# EAGLE design Addon-mapleCUx_OneWire-RS485-003 (EAGLE 7.3.0)
MAPLE-CUx Large Version
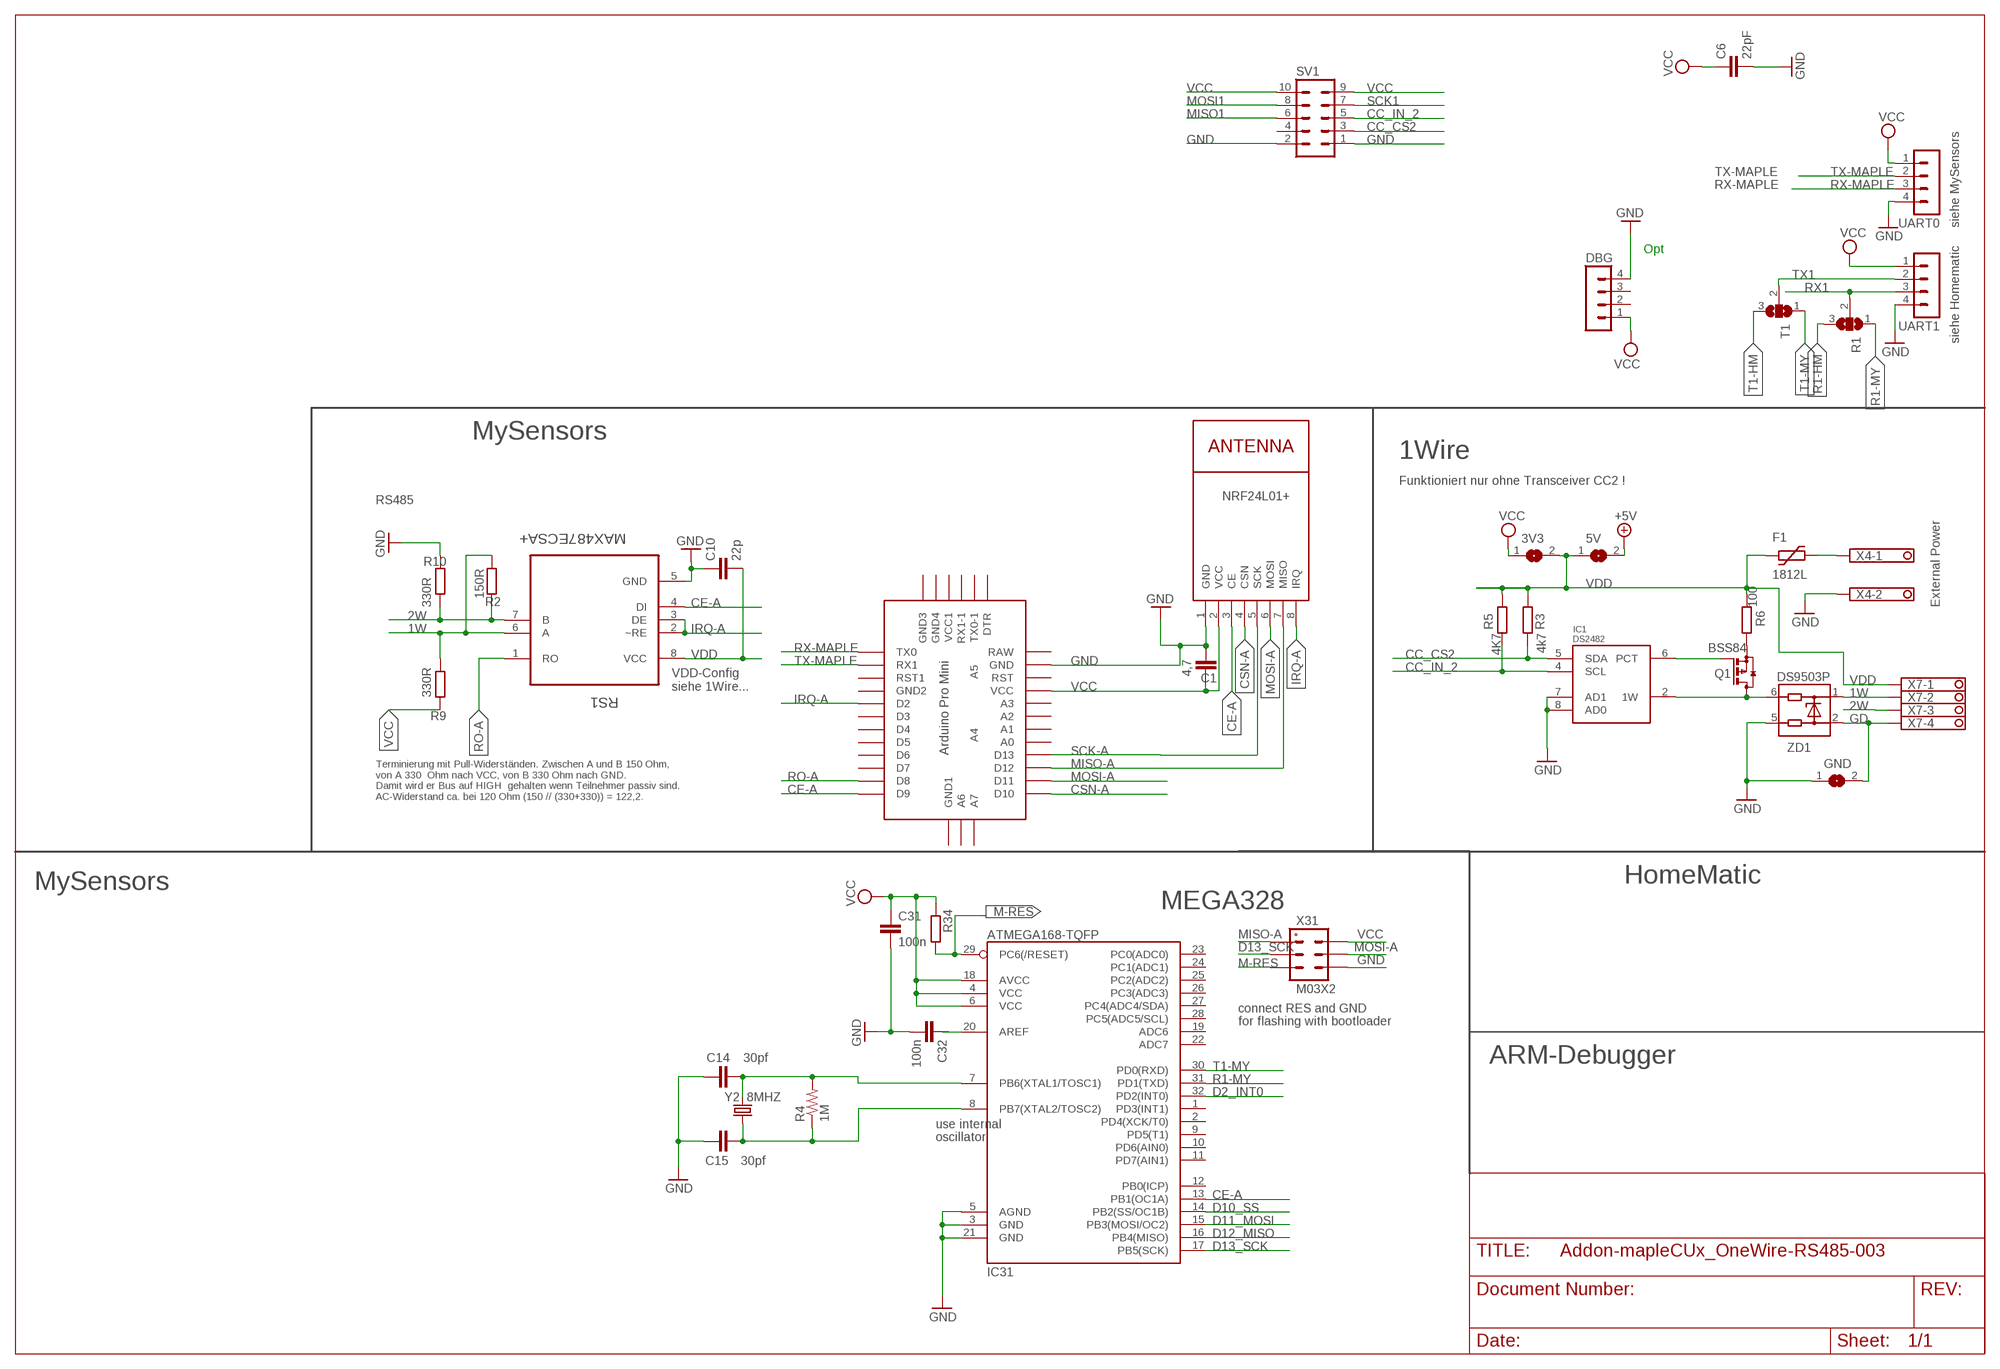
[diagram p0: schematic, sheet 1]

## Parts
3V3  SJ  [SJ]
5V  SJ  [SJ]
C1  4,7  C-EUC1210  [C1210]
C6  22pF  C-EUC0805  [C0805]
C10  22p  C-EUC0805  [C0805]
C14  30pf  CAP0805  [0805]
C15  30pf  CAP0805  [0805]
C31  100n  C-EUC0805  [C0805]
C32  100n  C-EUC0805  [C0805]
DBG  MA04-1  [MA04-1]
F1  1812L  [1812L]
GND  SJ  [SJ]
IC1  DS2482  DS2482-100S  [SO08]
IC31  ATMEGA168-TQFP  [TQFP32-08]
NRF24L01+  NRF24L01+  WIRELESS-NRF24L01  [WIRELESS-NRF24L01]
Q1  BSS84  [SOT23]
R1  SJ2W  [SJ_2]
R2  150R  R-EU_R0805  [R0805]
R3  4k7  R-EU_R0805  [R0805]
R4  1M  RESISTOR0805-RES  [0805]
R5  4K7  R-EU_R0805  [R0805]
R6  100  R-EU_R0805  [R0805]
R9  330R  R-EU_R0805  [R0805]
R10  330R  R-EU_R0805  [R0805]
R34  R-EU_R0805  [R0805]
RS1  MAX487ECSA+  [SOIC127P600X175-8N]
SV1  MA05-2  [MA05-2]
T1  SJ2W  [SJ_2]
U$1  ABK-PRO-MINI  [ABK-PRO-MINI]
UART0  MA04-1  [MA04-1]
UART1  MA04-1  [MA04-1]
X4  1751248  [1751248]
X7  1751264  [1751264]
X31  M03X2  [2X03-1.27MM_SMD]
Y2  8MHZ  CRYSTALTXC-7A  [CRYSTAL-TXC-7A]
ZD1  DS9503P  [TSOC6]

## Nets
1W: R2.1 R9.2 RS1.6(A) X7.2 ZD1.1
2W: R2.2 R10.1 RS1.7(B) X7.3
+5V [PWR]: 5V.2
CC_CS2: IC1.5(SDA) R3.2 SV1.3
CC_IN_2: IC1.4(SCL) R5.2 SV1.5
CE-A: IC31.13(PB1(OC1A)) NRF24L01+.3(CE) RS1.4(DI) U$1.D9
CSN-A: NRF24L01+.4(CSN) U$1.D10
D2_INT0: IC31.32(PD2(INT0))
D10_SS: IC31.14(PB2(SS/OC1B))
D11_MOSI: IC31.15(PB3(MOSI/OC2))
D12_MISO: IC31.16(PB4(MISO))
D13_SCK: IC31.17(PB5(SCK)) X31.P$3
GD [PWR]: GND.2 X7.4 ZD1.2
GND [PWR]: C1.1 C6.2 C10.1 C14.1 C15.1 C31.2 C32.2 DBG.4 GND.1 IC1.7(AD1) IC1.8(AD0) IC31.3(GND) IC31.5(AGND) IC31.21(GND) NRF24L01+.1(GND) R10.2 RS1.5(GND) SV1.1 SV1.2 U$1.GND UART0.4 UART1.4 X4.2 X31.P$6 ZD1.5
IRQ-A: NRF24L01+.8(IRQ) RS1.2(~RE) RS1.3(DE) U$1.D2
M-RES: IC31.29(PC6(/RESET)) R34.2 X31.P$5
MISO1: SV1.6
MISO-A: NRF24L01+.7(MISO) U$1.D12 X31.P$1
MOSI1: SV1.8
MOSI-A: NRF24L01+.6(MOSI) U$1.D11 X31.P$4
N$3: C14.2 IC31.7(PB6(XTAL1/TOSC1)) R4.2 Y2.P$2
N$13: C32.1 IC31.20(AREF)
N$19: C15.2 IC31.8(PB7(XTAL2/TOSC2)) R4.1 Y2.P$1
N$45 [PWR]: F1.P$2 X4.1
N$47: IC1.6(PCT) Q1.1(G)
N$48: IC1.2(1W) Q1.3(D) ZD1.6
N$52: Q1.2(S) R6.1
R1-HM: R1.3
R1-MY: IC31.31(PD1(TXD)) R1.1
RO-A: RS1.1(RO) U$1.D8
RX1: R1.2 UART1.3
RX-MAPLE: U$1.TX0 UART0.3
SCK1: SV1.7
SCK-A: NRF24L01+.5(SCK) U$1.D13
T1-HM: T1.3
T1-MY: IC31.30(PD0(RXD)) T1.1
TX1: T1.2 UART1.2
TX-MAPLE: U$1.RX1 UART0.2
VCC [PWR]: 3V3.1 C1.2 C6.1 C31.1 DBG.1 IC31.4(VCC) IC31.6(VCC) IC31.18(AVCC) NRF24L01+.2(VCC) R9.1 R34.1 SV1.9 SV1.10 U$1.VCC UART0.1 UART1.1 X31.P$2
VDD [PWR]: 3V3.2 5V.1 C10.2 F1.P$1 R3.1 R5.1 R6.2 RS1.8(VCC) X7.1
Unconnected: DBG.2 DBG.3 IC31.1(PD3(INT1)) IC31.2(PD4(XCK/T0)) IC31.9(PD5(T1)) IC31.10(PD6(AIN0)) IC31.11(PD7(AIN1)) IC31.12(PB0(ICP)) IC31.19(ADC6) IC31.22(ADC7) IC31.23(PC0(ADC0)) IC31.24(PC1(ADC1)) IC31.25(PC2(ADC2)) IC31.26(PC3(ADC3)) IC31.27(PC4(ADC4/SDA)) IC31.28(PC5(ADC5/SCL)) SV1.4 U$1.A0 U$1.A1 U$1.A2 U$1.A3 U$1.A4 U$1.A5 U$1.A6 U$1.A7 U$1.D3 U$1.D4 U$1.D5 U$1.D6 U$1.D7 U$1.DTR U$1.GND1(GND2) U$1.GND2(GND3) U$1.GND3(GND4) U$1.GND4(GND1) U$1.RAW U$1.RST U$1.RST1 U$1.RX1-1 U$1.TX0-1 U$1.VCC1

## Notes on the sheet
- siehe MySensors
- Opt
- siehe Homematic
- MySensors
- 1Wire
- Funktioniert nur ohne Transceiver CC2 !
- RS485
- External Power
- VDD-Config
  siehe 1Wire...
- Terminierung mit Pull-Widerständen. Zwischen A und B 150 Ohm,
  von A 330  Ohm nach VCC, von B 330 Ohm nach GND. 
  Damit wird er Bus auf HIGH  gehalten wenn Teilnehmer passiv sind.
  AC-Widerstand ca. bei 120 Ohm (150 // (330+330)) = 122,2.
- MySensors | HomeMatic
- MEGA328
- connect RES and GND
- for flashing with bootloader
- ARM-Debugger
- use internal
- oscillator

## Power pins joined to a net without a drawn wire
GND: IC1.3(GND)
VDD: IC1.1(VDD)

## Library data of the parts
3V3 5V GND = jumper:SJ: SMD solder JUMPER
C1 C6 C10 C31 C32 = rcl:C-EU: CAPACITOR, European symbol
C14 C15 = doug:CAP: Capacitor Standard 0603 ceramic capacitor, and 0.1" leaded capacitor.
DBG UART0 UART1 = con-lstb:MA04-1: PIN HEADER; OC_FARNELL: unknown; OC_NEWARK: unknown
F1 = ptc-littlefuse:1812L
IC1 = 1wire:DS2482-100: I2C to 1-Wire Host Adapter/Line Driver This device is a onewire host and I2C interface in one chip. It provides the complete DC/AC requirements for onewire communication, including overdrive speed mode, but, unlike the DS2480B chip, no 12V EPROM programming. Notes: For overdrive speed and 5V EEPROM programming, an external active pullup circuit must be connected to the 1W, VDD and PCT pin. See the datasheet for details. The lower two I2C adress bits of the chip can be selected by external pins, so up to 4 chips may be connected to the same I2C bus. Author: Orginal device and description from Giovanni Varasano <giovanni.varasano@fastwebnet.it> Improved by Jan Kandziora <jjj@gmx.de>
IC31 = atmel:ATMEGA168: Atmel Atmega 168/328/328P
NRF24L01+ = diy-modules:WIRELESS-NRF24L01: 2.4 GHz Wireless Module based on NRF24L01 chip
Q1 = transistor-small-signal:BSS84: P-CHANNEL MOS FET
R1 T1 = jumper:SJ2W: SMD solder JUMPER
R2 R3 R5 R6 R9 R10 R34 = rcl:R-EU_: RESISTOR, European symbol
R4 = doug:RESISTOR: Resistor Basic schematic elements and footprints for 0603, 1206, and PTH resistors.
RS1 = Maxim_By_element14_Batch_1:MAX487ECSA+: Low-Power, Slew-Rate-Limited RS-485/RS-422 Transceivers; MPN: MAX487ECSA+; OC_FARNELL: 9724532; OC_NEWARK: 68K4803; PACKAGE: SOIC-8; SUPPLIER: Maxim
SV1 = con-lstb:MA05-2: PIN HEADER; OC_FARNELL: unknown; OC_NEWARK: unknown
U$1 = Arduino-clone:ABK-PRO-MINI: ABK Pro-Mini Arduino Clone
X4 = con-phoenix-350:1751248: MKDS 1/ 2-3,5 Printklemme Nennstrom: 10 A Bemessungsspannung: 160 V Raster: 3,5 mm Polzahl: 2 Montageart: Löten Anschlussart: Schraubanschluss Anschlussrichtung vom Leiter zur Platine: 0° Source: http://eshop.phoenixcontact.com .. 1751248.pdf; OC_FARNELL: unknown; OC_NEWARK: unknown
X7 = con-phoenix-350:1751264: MKDS 1/ 4-3,5 Printklemme Nennstrom: 10 A Bemessungsspannung: 160 V Raster: 3,5 mm Polzahl: 4 Montageart: Löten Anschlussart: Schraubanschluss Anschlussrichtung vom Leiter zur Platine: 0° Source: http://eshop.phoenixcontact.com .. 1751264.pdf; MPN: 1751264; OC_FARNELL: unknown; OC_NEWARK: 10R0934
X31 = mechanics:M03X2
Y2 = SparkFun-FreqCtrl:CRYSTAL: Various standard crystals. Proven footprints.
ZD1 = 1wire:DS9503: ESD Protection Diode with Resistors This ESD protection diode is designed especially for onewire host interfaces. Unlike the DS9502, it has two additional 5Ohm resitors in the 1W and GND line. Pin 5 and 6 have to be connected to the host side, pin 1 und 2 to the network side. The 1W line is through pin 1 and 6, the GND line is through pin 2 and 5. Author: Jan Kandziora <jjj@gmx.de>

## Net classes
0 default: width 0.305 mm
1 PWR: width 0.457 mm

## Board
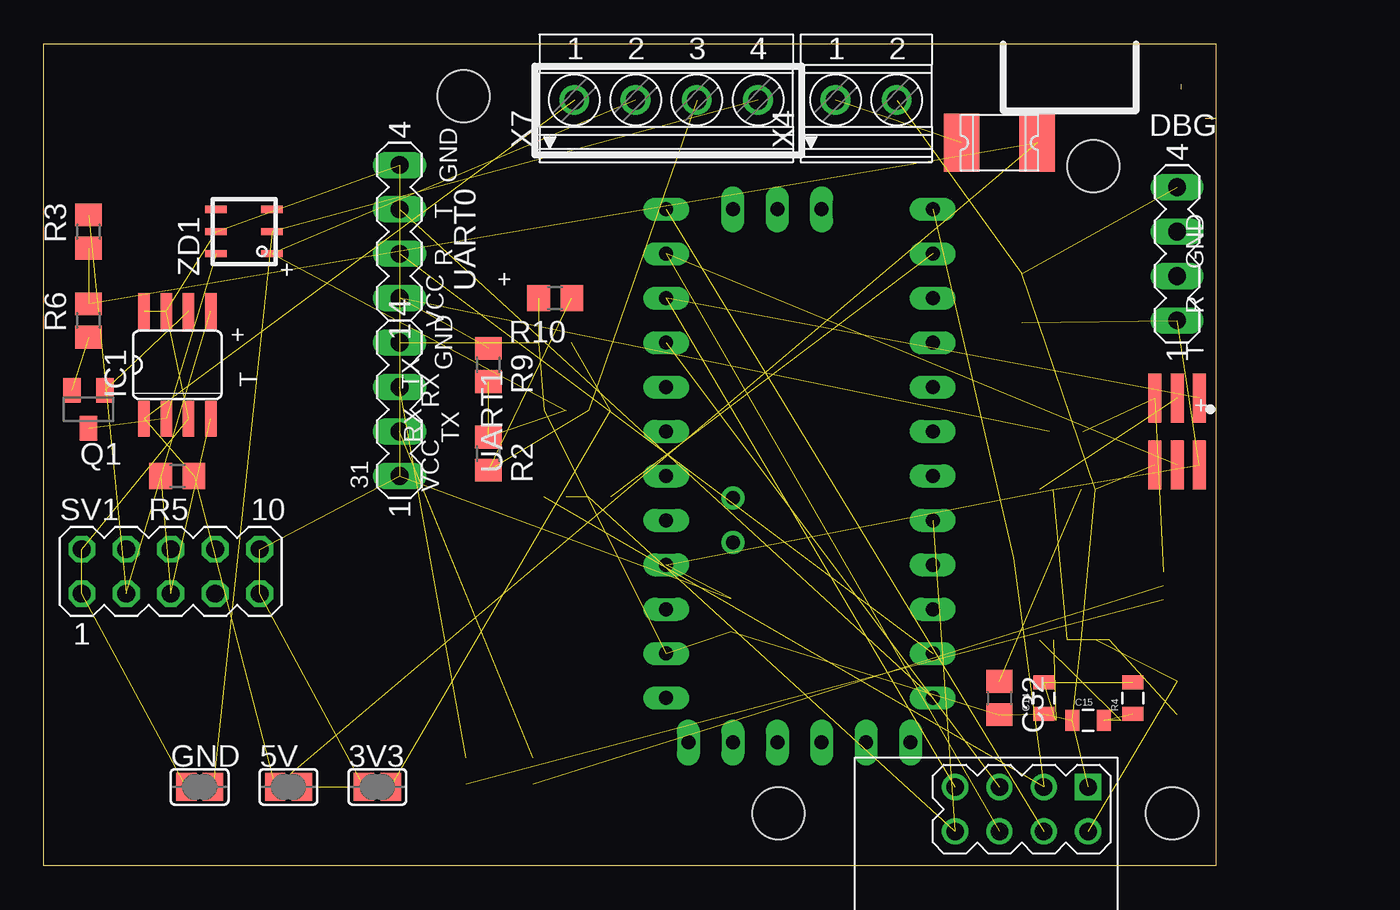
[diagram p1: board, top side]
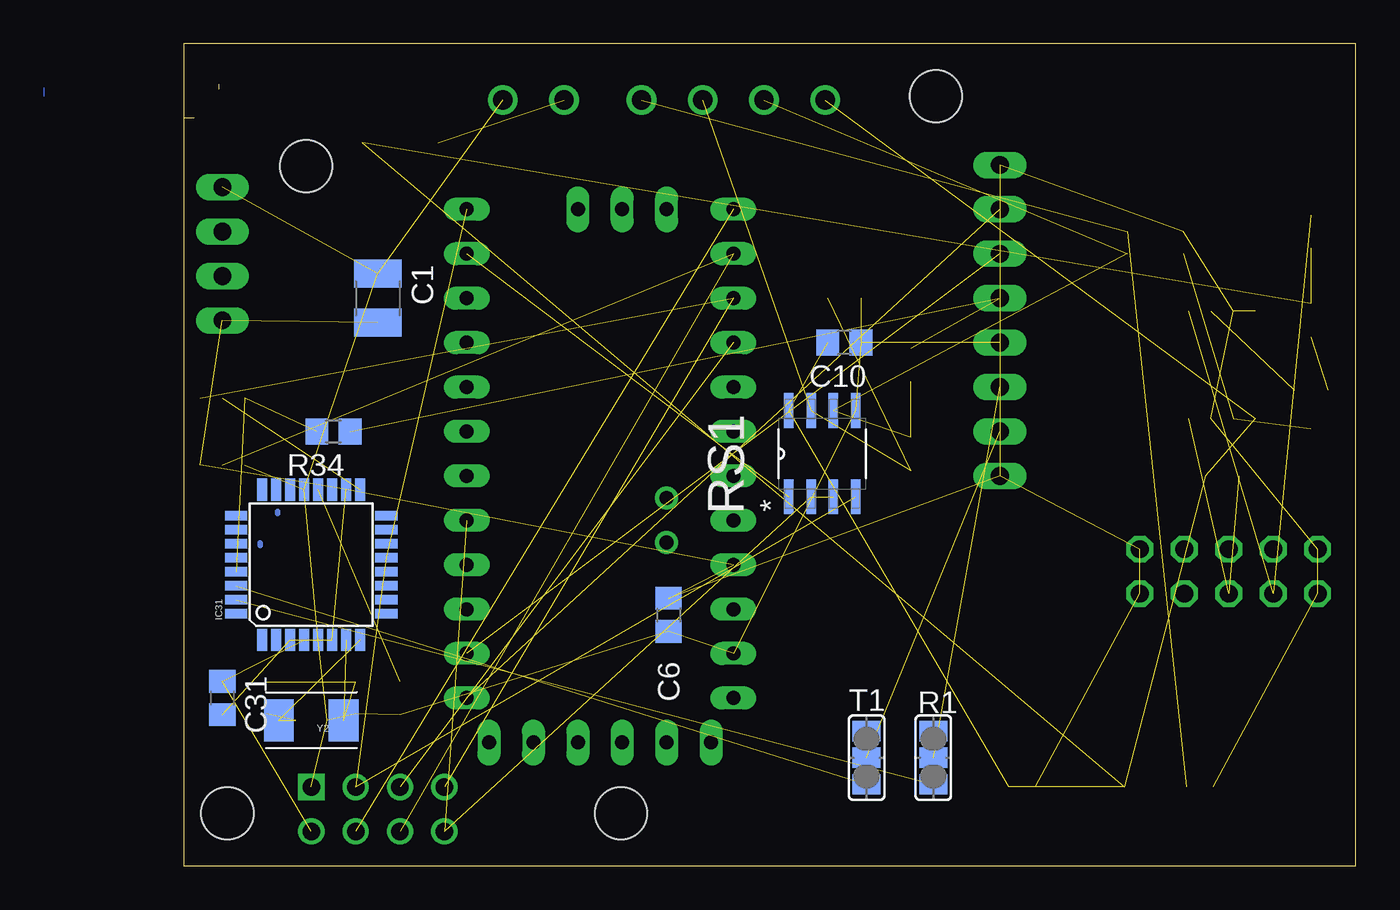
[diagram p2: board, bottom side, seen from below]

Size 67 x 47 mm. Coordinates in mm from the lower left corner, seen from the top.
Outline: 67,47 67,46.24
Outline: 65,44.7 65,44.41
Outline: 66.41,42.75 67,42.75
Outline: 67,47 0,47 0,0 67,0 67,42.75
Outline: 67,47 67,42.75
Copper layers (1*16): Top 0.035mm / dielectric 1.5mm / Bottom 0.035mm
Design rules "SeeedStudio_2layer_DRU_no_angle_20140221": minimum track width 6mil, minimum drill 12mil, track to track 6mil, track to pad 6mil, pad to pad 6mil, via to via 6mil, smd to smd 0mil, copper to edge 10mil, drill to drill 10mil, minimum pad ring 10mil, minimum via ring 6mil, stop-mask expansion 2mil, vias tented up to drill 100mil, thermal gap 10mil
Holes 3 mm at 60,40 24,44 42,3 64.5,3

### Footprints (pad centres in the part's own frame; a part is rotated, then mirrored left to right if it is on the bottom)
SJ = smd 1.168 x 1.6: 1 -0.762,0; 2 0.762,0
C1210 = smd 1.6 x 2.7: 1 -1.4,0; 2 1.4,0
C0805 = smd 1.3 x 1.5: 1 -0.95,0; 2 0.95,0
0805 = smd 0.8 x 1.2: 1 -0.9,0; 2 0.9,0
MA04-1 = drill 1.016 long: 1 -3.81,0; 2 -1.27,0; 3 1.27,0; 4 3.81,0
1812L = smd 2.03 x 3.3: P$1 -2.16,0; P$2 2.16,0
SO08 = smd 0.66 x 2.032: 1 -1.905,-3.073; 2 -0.635,-3.073; 3 0.635,-3.073; 4 1.905,-3.073; 5 1.905,3.073; 6 0.635,3.073; 7 -0.635,3.073; 8 -1.905,3.073
TQFP32-08 = smd 1.27 x 0.559: 1 -4.293,2.8; 2 -4.293,2; 3 -4.293,1.2; 4 -4.293,0.4; 5 -4.293,-0.4; 6 -4.293,-1.2; 7 -4.293,-2; 8 -4.293,-2.8; 17 4.293,-2.8; 18 4.293,-2; 19 4.293,-1.2; 20 4.293,-0.4; 21 4.293,0.4; 22 4.293,1.2; 23 4.293,2; 24 4.293,2.8 | smd 0.559 x 1.27: 9 -2.8,-4.293; 10 -2,-4.293; 11 -1.2,-4.293; 12 -0.4,-4.293; 13 0.4,-4.293; 14 1.2,-4.293; 15 2,-4.293; 16 2.8,-4.293; 25 2.8,4.293; 26 2,4.293; 27 1.2,4.293; 28 0.4,4.293; 29 -0.4,4.293; 30 -1.2,4.293; 31 -2,4.293; 32 -2.8,4.293
WIRELESS-NRF24L01 = drill 1 square: 1 -12.7,6.35 | drill 1: 2 -10.16,6.35; 3 -12.7,3.81; 4 -10.16,3.81; 5 -12.7,1.27; 6 -10.16,1.27; 7 -12.7,-1.27; 8 -10.16,-1.27
SOT23 = smd 1 x 1.4: 1 -0.95,-1.1; 2 0.95,-1.1; 3 0,1.1
SJ_2 = smd 1.168 x 1.6: 1 -1.524,0; 2 0,0; 3 1.524,0
R0805 = smd 1.3 x 1.5: 1 -0.95,0; 2 0.95,0
SOIC127P600X175-8N = smd 1.981 x 0.533: 1 -2.464,1.905; 2 -2.464,0.635; 3 -2.464,-0.635; 4 -2.464,-1.905; 5 2.464,-1.905; 6 2.464,-0.635; 7 2.464,0.635; 8 2.464,1.905
MA05-2 = drill 1.016 octagon: 1 -5.08,-1.27; 2 -5.08,1.27; 3 -2.54,-1.27; 4 -2.54,1.27; 5 0,-1.27; 6 0,1.27; 7 2.54,-1.27; 8 2.54,1.27; 9 5.08,-1.27; 10 5.08,1.27
ABK-PRO-MINI = drill 0.8 long: A0 10.16,-3.81; A1 10.16,-6.35; A2 10.16,-8.89; A3 10.16,-11.43; A6 3.81,-21.59; A7 6.35,-21.59; D2 -5.08,-3.81; D3 -5.08,-6.35; D4 -5.08,-8.89; D5 -5.08,-11.43; D6 -5.08,-13.97; D7 -5.08,-16.51; D8 -5.08,-19.05; D9 -5.08,-21.59; D10 10.16,-21.59; D11 10.16,-19.05; D12 10.16,-16.51; D13 10.16,-13.97; DTR 8.89,8.89; GND 10.16,3.81; GND1 -5.08,-1.27; GND2 -3.81,8.89; GND3 -1.27,8.89; GND4 1.27,-21.59; RAW 10.16,6.35; RST 10.16,1.27; RST1 -5.08,1.27; RX1 -5.08,3.81; RX1-1 3.81,8.89; TX0 -5.08,6.35; TX0-1 6.35,8.89; VCC 10.16,-1.27; VCC1 1.27,8.89 | drill 0.8: A4 6.35,-5.08; A5 6.35,-2.54
1751248 = drill 1.1 pad 1.7: 1 -1.75,-0.1; 2 1.75,-0.1
1751264 = drill 1.1 pad 1.7: 1 -5.25,-0.1; 2 -1.75,-0.1; 3 1.75,-0.1; 4 5.25,-0.1
2X03-1.27MM_SMD = smd 0.75 x 2.8: P$1 -1.27,-1.905; P$2 -1.27,1.905; P$3 0,-1.905; P$4 0,1.905; P$5 1.27,-1.905; P$6 1.27,1.905
CRYSTAL-TXC-7A = smd 1.7 x 2.4: P$1 1.85,0; P$2 -1.85,0
TSOC6 = smd 0.406 x 1.219: 1 -1.27,-1.6; 2 0,-1.6; 3 1.27,-1.6; 4 1.27,1.6; 5 0,1.6; 6 -1.27,1.6

### Placement (x,y rotation side)
3V3  19.07,4.51 0 top
5V  13.99,4.51 0 top
C1  55.9,32.45 270 bottom
C6  39.28,14.34 270 bottom
C10  29.23,29.91 180 bottom
C14  57.17,9.59 90 top
C15  59.71,8.32 0 top
C31  64.79,9.59 270 bottom
C32  54.63,9.59 270 top
DBG  64.79,34.99 90 top
F1  54.63,41.34 180 top
GND  8.91,4.51 0 top
IC1  7.64,28.64 0 top
IC31  59.71,17.21 90 bottom
NRF24L01+  53.36,-8.19 270 top
Q1  2.56,26.1 180 top
R1  24.15,6.18 90 bottom
R2  25.42,23.56 270 top
R3  2.56,36.26 90 top
R4  62.25,9.59 90 top
R5  7.64,22.29 180 top
R6  2.56,31.18 90 top
R9  25.42,28.64 270 top
R10  29.23,32.45 180 top
R34  58.44,24.83 180 bottom
RS1  30.5,23.56 90 bottom
SV1  7.26,16.83 0 top
T1  27.96,6.18 90 bottom
U$1  45.74,15.94 180 top
UART0  20.34,36.26 90 top
UART1  20.34,26.1 90 top
X4  47.01,43.88 0 top
X7  35.58,43.88 0 top
X31  64.79,24.83 180 top
Y2  59.71,8.32 180 bottom
ZD1  11.45,36.26 90 top

### Tracks (layer width: path | path; a pad name or v marks a point on that pad's centre or on a via)
1W  (4 unrouted)
2W  (3 unrouted)
CC_CS2  (2 unrouted)
CC_IN_2  (2 unrouted)
CE-A  (3 unrouted)
CSN-A  (1 unrouted)
D13_SCK  (1 unrouted)
GD  (2 unrouted)
GND  (25 unrouted)
IRQ-A  (3 unrouted)
M-RES  (2 unrouted)
MISO-A  (2 unrouted)
MOSI-A  (2 unrouted)
N$3  (3 unrouted)
N$5
  Bottom 0: 75,44.5 75,44
N$6
  Bottom 0.305: 62.61,18.32 62.61,18.45
N$9
  Bottom 0.305: 61.61,20.13 61.61,20.26
N$13  (1 unrouted)
N$19  (3 unrouted)
N$45  (1 unrouted)
N$47  (1 unrouted)
N$48  (2 unrouted)
N$52  (1 unrouted)
R1-MY  (1 unrouted)
RO-A  (1 unrouted)
RX1  (1 unrouted)
RX-MAPLE  (1 unrouted)
SCK-A  (1 unrouted)
T1-MY  (1 unrouted)
TX1  (1 unrouted)
TX-MAPLE  (1 unrouted)
VCC  (16 unrouted)
VDD  (9 unrouted)

### Text on the board
tNames: GND | T | R | + | GND | + | GND | R | VCC | + | T | T | TX | + | RX | RX | TX | 31 | VCC
bNames: Ant3